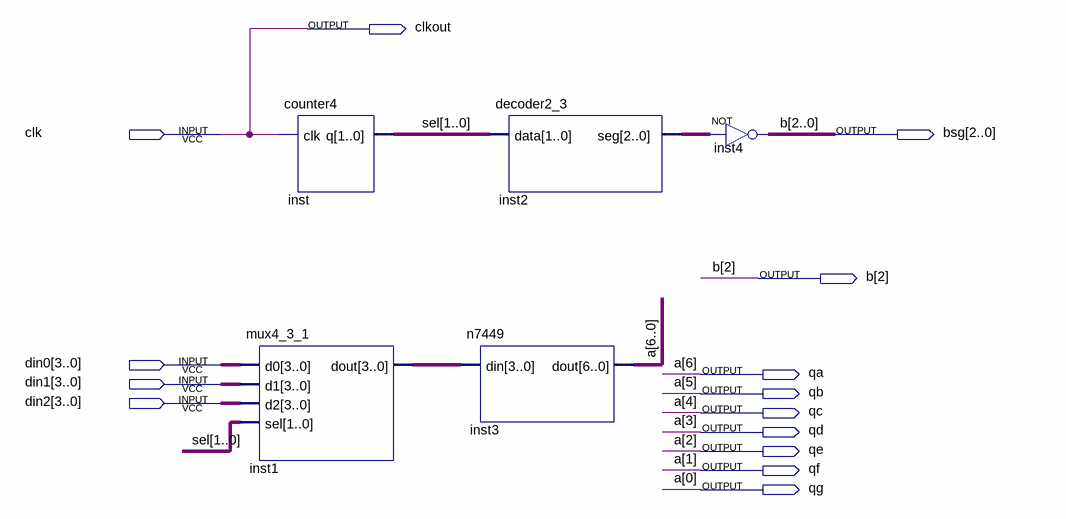
[diagram p0: schematic sheet]
// Quartus schematic scan_led3.bdf as structural Verilog: 5 symbols, 14 pins
module scan_led3 (
  input  clk,
  input  [3:0] din0,
  input  [3:0] din1,
  input  [3:0] din2,
  output clkout,
  output [2:0] bsg,
  output [2:2] b,
  output qa,
  output qb,
  output qc,
  output qd,
  output qe,
  output qf,
  output qg
);

  wire [1:0] sel;
  wire [2:0] inst2_seg;
  wire [3:0] inst1_dout;

  counter4 inst (.clk(clk), .q(sel));
  mux4_3_1 inst1 (.d0(din0), .d1(din1), .d2(din2), .sel(sel), .dout(inst1_dout));
  n7449 inst3 (.din(inst1_dout), .dout({qa, qb, qc, qd, qe, qf, qg}));
  decoder2_3 inst2 (.data(sel), .seg(inst2_seg));
  assign {b[2], bsg[1:0]} = ~inst2_seg;  // NOT inst4, 3 bits wide

  assign bsg[2] = b[2];
  assign clkout = clk;

  // Other names for the same wires on the sheet: a[6:0] = {qa, qb, qc, qd, qe, qf, qg}; b[1:0] = bsg[1:0]
endmodule
